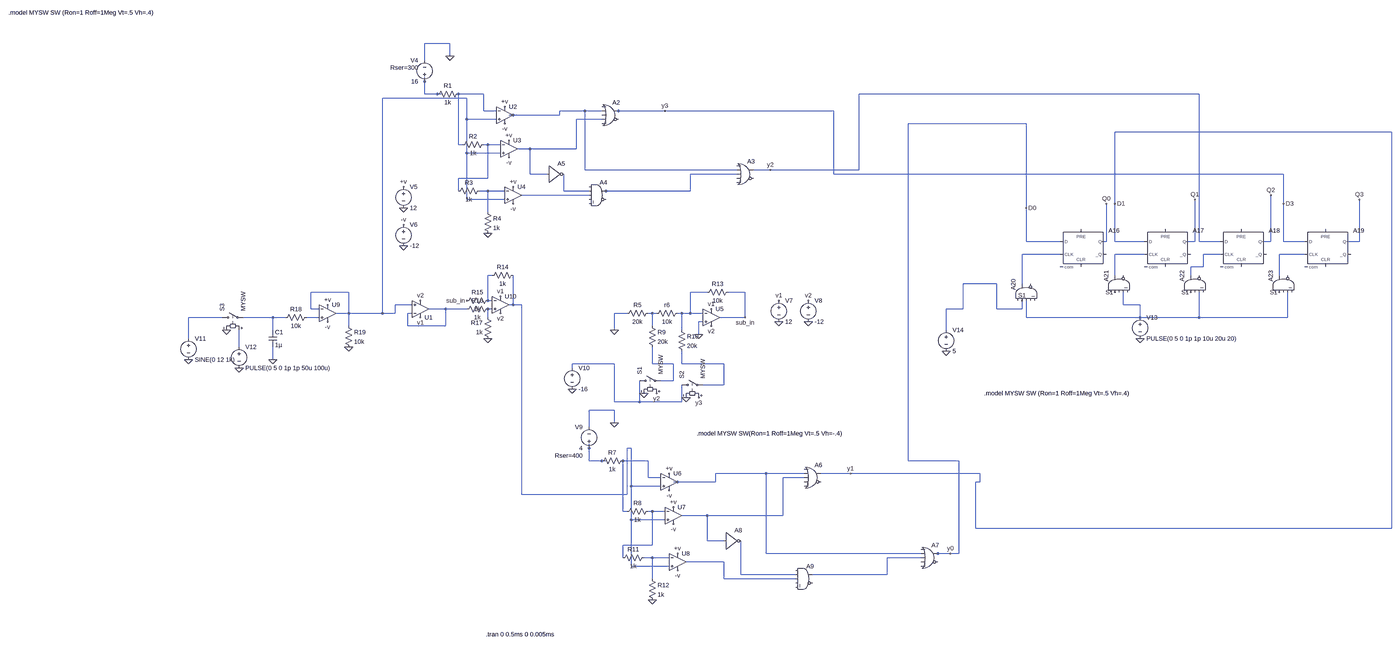
[diagram p0: schematic 4bit adc(half-flash).asc, whole sheet]
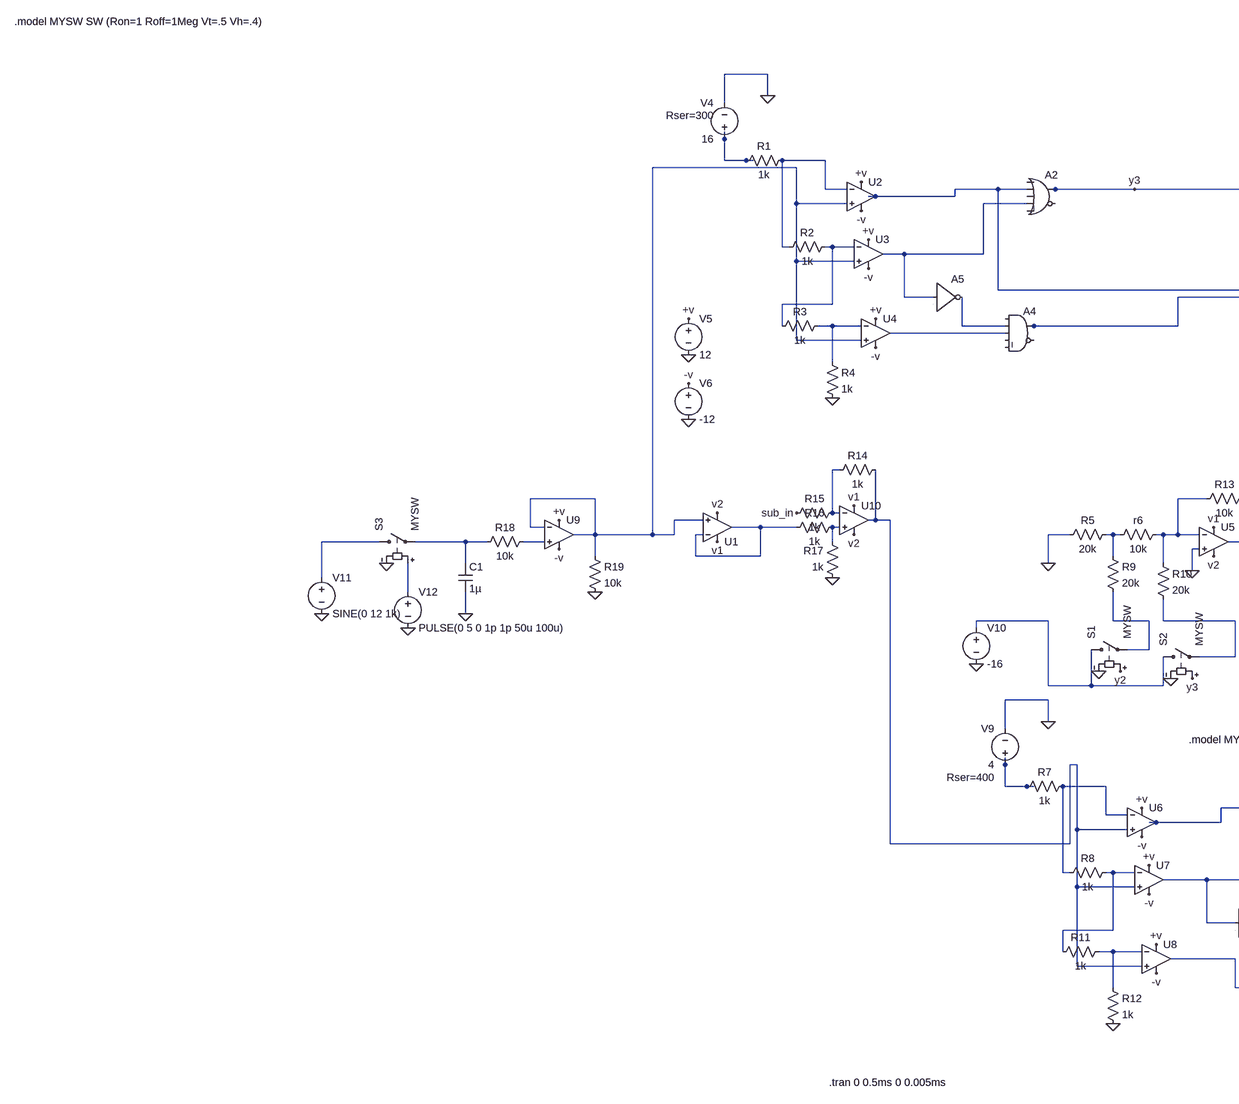
[diagram p1: schematic 4bit adc(half-flash).asc, part, row 1 of 1, column 1 of 2]
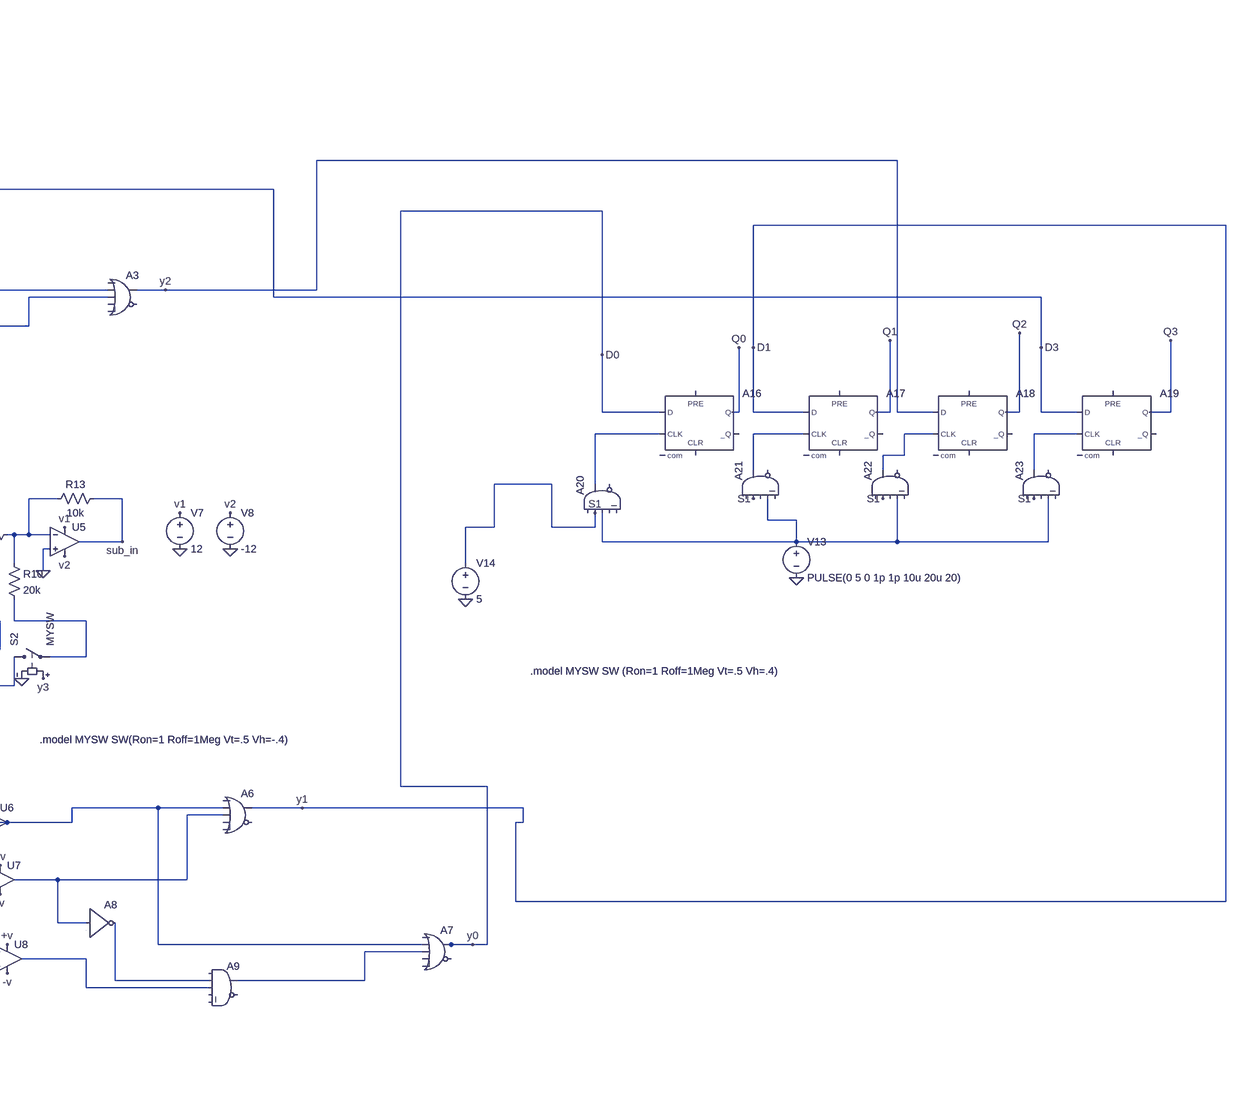
[diagram p2: schematic 4bit adc(half-flash).asc, part, row 1 of 1, column 2 of 2]
4bit adc(half-flash).asc, the LTspice schematic file:
Version 4
SHEET 1 3524 1444
WIRE -432 -832 -528 -832
WIRE -432 -784 -432 -832
WIRE -528 -768 -528 -832
WIRE -528 -688 -528 -704
WIRE -528 -640 -528 -688
WIRE -480 -640 -528 -640
WIRE -464 -640 -480 -640
WIRE -304 -640 -400 -640
WIRE 2416 -640 1120 -640
WIRE -368 -624 -688 -624
WIRE -304 -576 -304 -640
WIRE -256 -576 -304 -576
WIRE 80 -576 -16 -576
WIRE 144 -576 80 -576
WIRE 208 -576 192 -576
WIRE 384 -576 208 -576
WIRE 1024 -576 384 -576
WIRE -192 -560 -208 -560
WIRE -16 -560 -16 -576
WIRE -16 -560 -192 -560
WIRE -368 -544 -368 -624
WIRE -256 -544 -368 -544
WIRE 144 -544 48 -544
WIRE 1760 -528 1312 -528
WIRE 3520 -496 2096 -496
WIRE -400 -448 -400 -640
WIRE -384 -448 -400 -448
WIRE -288 -448 -304 -448
WIRE -240 -448 -288 -448
WIRE -128 -432 -176 -432
WIRE 48 -432 48 -544
WIRE 48 -432 -128 -432
WIRE -368 -416 -368 -544
WIRE -240 -416 -368 -416
WIRE 80 -352 80 -576
WIRE 656 -352 80 -352
WIRE 784 -352 720 -352
WIRE 1120 -352 1120 -640
WIRE 1120 -352 784 -352
WIRE -128 -336 -128 -432
WIRE -64 -336 -128 -336
WIRE 656 -336 480 -336
WIRE 1024 -336 1024 -576
WIRE 2736 -336 1024 -336
WIRE -288 -320 -288 -448
WIRE -288 -320 -400 -320
WIRE -400 -272 -400 -320
WIRE -288 -272 -320 -272
WIRE -224 -272 -288 -272
WIRE 0 -272 0 -336
WIRE 96 -272 0 -272
WIRE 160 -272 144 -272
WIRE 480 -272 480 -336
WIRE 480 -272 160 -272
WIRE 96 -256 -160 -256
WIRE -368 -240 -368 -416
WIRE -224 -240 -368 -240
WIRE 2096 -224 2096 -496
WIRE 2736 -224 2736 -336
WIRE 1760 -208 1760 -528
WIRE -288 -192 -288 -272
WIRE 1760 -80 1760 -208
WIRE 1888 -80 1760 -80
WIRE 2064 -80 2064 -224
WIRE 2064 -80 2048 -80
WIRE 2096 -80 2096 -224
WIRE 2208 -80 2096 -80
WIRE 2400 -80 2400 -240
WIRE 2400 -80 2368 -80
WIRE 2416 -80 2416 -640
WIRE 2496 -80 2416 -80
WIRE 2688 -80 2688 -256
WIRE 2688 -80 2656 -80
WIRE 2736 -80 2736 -224
WIRE 2816 -80 2736 -80
WIRE 3024 -80 3024 -240
WIRE 3024 -80 2976 -80
WIRE 1888 -32 1744 -32
WIRE 2208 -32 2096 -32
WIRE 2496 -32 2432 -32
WIRE 2816 -32 2720 -32
WIRE 2432 16 2432 -32
WIRE 2432 16 2384 16
WIRE -272 48 -288 48
WIRE 2096 48 2096 -32
WIRE 2384 48 2384 16
WIRE 2720 48 2720 -32
WIRE 1648 80 1520 80
WIRE 1744 80 1744 -32
WIRE -816 112 -960 112
WIRE 544 112 480 112
WIRE 688 112 624 112
WIRE -288 144 -288 48
WIRE -272 144 -288 144
WIRE -576 160 -640 160
WIRE -192 160 -192 48
WIRE -192 160 -208 160
WIRE -160 160 -192 160
WIRE 2128 160 2128 112
WIRE 2192 160 2128 160
WIRE -960 176 -960 112
WIRE -928 176 -960 176
WIRE -448 176 -512 176
WIRE -368 176 -448 176
WIRE -272 176 -288 176
WIRE 1520 176 1520 80
WIRE 1520 176 1456 176
WIRE 1648 176 1648 80
WIRE 1744 176 1744 144
WIRE 1744 176 1648 176
WIRE -816 192 -816 112
WIRE -816 192 -864 192
WIRE -688 192 -688 -624
WIRE -688 192 -816 192
WIRE -640 192 -640 160
WIRE -640 192 -688 192
WIRE -576 192 -592 192
WIRE 240 192 192 192
WIRE 336 192 320 192
WIRE 352 192 336 192
WIRE 448 192 432 192
WIRE 480 192 480 112
WIRE 480 192 448 192
WIRE 528 192 480 192
WIRE -1296 208 -1424 208
WIRE -1104 208 -1216 208
WIRE -1056 208 -1104 208
WIRE -928 208 -976 208
WIRE -288 208 -288 176
WIRE 688 208 688 112
WIRE 688 208 592 208
WIRE 1760 208 1760 144
WIRE 2192 208 2192 160
WIRE 2192 208 1760 208
WIRE 2416 208 2416 112
WIRE 2416 208 2192 208
WIRE 2752 208 2752 112
WIRE 2752 208 2416 208
WIRE 528 224 512 224
WIRE -816 240 -816 192
WIRE -592 240 -592 192
WIRE -448 240 -448 176
WIRE -448 240 -592 240
WIRE 336 240 336 192
WIRE -1104 256 -1104 208
WIRE 192 256 192 192
WIRE 448 256 448 192
WIRE 1456 256 1456 176
WIRE 512 272 512 224
WIRE -1424 288 -1424 208
WIRE -1232 320 -1232 256
WIRE -1104 368 -1104 320
WIRE 192 384 32 384
WIRE 336 384 336 320
WIRE 416 384 336 384
WIRE 448 384 448 336
WIRE 608 384 448 384
WIRE 32 400 32 384
WIRE 416 448 416 384
WIRE 416 448 368 448
WIRE 608 464 608 384
WIRE 608 464 528 464
WIRE 192 528 192 384
WIRE 288 528 288 448
WIRE 288 528 192 528
WIRE 448 528 448 464
WIRE 448 528 288 528
WIRE 192 560 96 560
WIRE 192 608 192 560
WIRE 96 624 96 560
WIRE 96 704 96 688
WIRE 256 704 240 704
WIRE 96 752 96 704
WIRE 144 752 96 752
WIRE 160 752 144 752
WIRE 320 752 224 752
WIRE 1312 752 1312 -528
WIRE 1504 752 1312 752
WIRE 768 800 576 800
WIRE 912 800 768 800
WIRE 1088 800 976 800
WIRE 1584 800 1088 800
WIRE 320 816 320 752
WIRE 368 816 320 816
WIRE 912 816 832 816
WIRE 432 832 416 832
WIRE 576 832 576 800
WIRE 576 832 432 832
WIRE 1584 832 1584 800
WIRE 1584 832 1568 832
WIRE 256 848 256 704
WIRE 368 848 256 848
WIRE -160 880 -160 160
WIRE 240 880 240 704
WIRE 240 880 -160 880
WIRE 224 944 224 752
WIRE 240 944 224 944
WIRE 336 944 320 944
WIRE 384 944 336 944
WIRE 544 960 448 960
WIRE 832 960 832 816
WIRE 832 960 544 960
WIRE 256 976 256 848
WIRE 384 976 256 976
WIRE 1568 1008 1568 832
WIRE 3520 1008 3520 -496
WIRE 3520 1008 1568 1008
WIRE 544 1056 544 960
WIRE 608 1056 544 1056
WIRE 336 1072 336 944
WIRE 336 1072 224 1072
WIRE 768 1104 768 800
WIRE 1360 1104 768 1104
WIRE 1424 1104 1408 1104
WIRE 1472 1104 1424 1104
WIRE 1504 1104 1504 752
WIRE 1504 1104 1472 1104
WIRE 224 1120 224 1072
WIRE 336 1120 304 1120
WIRE 400 1120 336 1120
WIRE 1360 1120 1232 1120
WIRE 608 1136 464 1136
WIRE 256 1152 256 976
WIRE 400 1152 256 1152
WIRE 672 1184 672 1056
WIRE 880 1184 672 1184
WIRE 1232 1184 1232 1120
WIRE 1232 1184 944 1184
WIRE 336 1200 336 1120
WIRE 608 1200 608 1136
WIRE 880 1200 608 1200
FLAG 512 272 0
FLAG 560 176 v1
FLAG 560 240 v2
FLAG 192 256 0
FLAG 688 208 sub_in
FLAG -368 144 sub_in
FLAG 2192 288 0
FLAG 1456 336 0
FLAG 2096 112 S1
FLAG 2384 112 S1
FLAG 2720 112 S1
FLAG 1744 144 S1
FLAG 2064 -224 Q0
FLAG 2400 -240 Q1
FLAG 2688 -256 Q2
FLAG 3024 -240 Q3
FLAG 1760 -208 D0
FLAG 2096 -224 D1
FLAG 2736 -224 D3
FLAG 816 224 0
FLAG 928 144 v2
FLAG 816 144 v1
FLAG 928 224 0
FLAG -240 128 v1
FLAG -240 192 v2
FLAG -288 288 0
FLAG -544 208 v1
FLAG -544 144 v2
FLAG -432 -784 0
FLAG -288 -112 0
FLAG -608 -64 0
FLAG -608 -208 0
FLAG -608 -288 +v
FLAG -224 -592 +v
FLAG -208 -464 +v
FLAG -192 -288 +v
FLAG -608 -144 -v
FLAG -224 -528 -v
FLAG -208 -400 -v
FLAG -192 -224 -v
FLAG 192 608 0
FLAG 336 1280 0
FLAG 400 800 +v
FLAG 416 928 +v
FLAG 432 1104 +v
FLAG 400 864 -v
FLAG 416 992 -v
FLAG 432 1168 -v
FLAG 384 -576 y3
FLAG 784 -352 y2
FLAG 1088 800 y1
FLAG 1472 1104 y0
FLAG 32 480 0
FLAG 304 496 0
FLAG 464 512 0
FLAG 352 496 y2
FLAG 512 512 y3
FLAG -1104 368 0
FLAG -1232 400 0
FLAG -1424 368 0
FLAG -896 160 +v
FLAG -896 224 -v
FLAG -816 320 0
FLAG -1280 256 0
SYMBOL res 336 176 R90
WINDOW 0 0 56 VBottom 2
WINDOW 3 32 56 VTop 2
SYMATTR InstName R5
SYMATTR Value 20k
SYMBOL res 448 176 R90
WINDOW 0 0 56 VBottom 2
WINDOW 3 32 56 VTop 2
SYMATTR InstName r6
SYMATTR Value 10k
SYMBOL res 320 224 R0
SYMATTR InstName R9
SYMATTR Value 20k
SYMBOL res 432 240 R0
SYMATTR InstName R10
SYMATTR Value 20k
SYMBOL OpAmps\\UniversalOpAmp 560 208 R0
SYMATTR InstName U5
SYMBOL res 640 96 R90
WINDOW 0 0 56 VBottom 2
WINDOW 3 32 56 VTop 2
SYMATTR InstName R13
SYMATTR Value 10k
SYMBOL voltage 816 128 R0
WINDOW 123 0 0 Left 0
WINDOW 39 0 0 Left 0
SYMATTR InstName V7
SYMATTR Value 12
SYMBOL voltage 928 128 R0
WINDOW 123 0 0 Left 0
WINDOW 39 0 0 Left 0
SYMATTR InstName V8
SYMATTR Value -12
SYMBOL Digital\\dflop 1968 -128 R0
SYMATTR InstName A16
SYMBOL Digital\\dflop 2288 -128 R0
SYMATTR InstName A17
SYMBOL Digital\\dflop 2576 -128 R0
SYMATTR InstName A18
SYMBOL Digital\\dflop 2896 -128 R0
SYMATTR InstName A19
SYMBOL voltage 2192 192 R0
WINDOW 123 0 0 Left 0
WINDOW 39 0 0 Left 0
SYMATTR InstName V13
SYMATTR Value PULSE(0 5 0 1p 1p 10u 20u 20)
SYMBOL voltage 1456 240 R0
WINDOW 123 0 0 Left 0
WINDOW 39 0 0 Left 0
SYMATTR InstName V14
SYMATTR Value 5
SYMBOL Digital\\and 1696 112 R270
SYMATTR InstName A20
SYMBOL Digital\\and 2048 80 R270
SYMATTR InstName A21
SYMBOL Digital\\and 2336 80 R270
SYMATTR InstName A22
SYMBOL Digital\\and 2672 80 R270
SYMATTR InstName A23
SYMBOL res -176 32 R90
WINDOW 0 0 56 VBottom 2
WINDOW 3 32 56 VTop 2
SYMATTR InstName R14
SYMATTR Value 1k
SYMBOL res -272 128 R90
WINDOW 0 0 56 VBottom 2
WINDOW 3 32 56 VTop 2
SYMATTR InstName R15
SYMATTR Value 1k
SYMBOL res -272 160 R90
WINDOW 0 0 56 VBottom 2
WINDOW 3 32 56 VTop 2
SYMATTR InstName R16
SYMATTR Value 1k
SYMBOL res -272 304 R180
WINDOW 0 36 76 Left 2
WINDOW 3 36 40 Left 2
SYMATTR InstName R17
SYMATTR Value 1k
SYMBOL OpAmps\\UniversalOpAmp2 -240 160 R0
SYMATTR InstName U10
SYMBOL OpAmps\\UniversalOpAmp2 -544 176 M180
SYMATTR InstName U1
SYMBOL OpAmps\\UniversalOpAmp2 -224 -560 R0
SYMATTR InstName U2
SYMBOL OpAmps\\UniversalOpAmp2 -208 -432 R0
SYMATTR InstName U3
SYMBOL OpAmps\\UniversalOpAmp2 -192 -256 R0
SYMATTR InstName U4
SYMBOL voltage -528 -672 R180
WINDOW 0 24 96 Left 2
WINDOW 3 24 16 Left 2
WINDOW 123 0 0 Left 0
WINDOW 39 24 68 Left 2
SYMATTR InstName V4
SYMATTR Value 16
SYMATTR SpiceLine Rser=300
SYMBOL res -384 -656 R90
WINDOW 0 0 56 VBottom 2
WINDOW 3 32 56 VTop 2
SYMATTR InstName R1
SYMATTR Value 1k
SYMBOL res -288 -464 R90
WINDOW 0 0 56 VBottom 2
WINDOW 3 32 56 VTop 2
SYMATTR InstName R2
SYMATTR Value 1k
SYMBOL res -304 -288 R90
WINDOW 0 0 56 VBottom 2
WINDOW 3 32 56 VTop 2
SYMATTR InstName R3
SYMATTR Value 1k
SYMBOL res -304 -208 R0
SYMATTR InstName R4
SYMATTR Value 1k
SYMBOL voltage -608 -304 R0
WINDOW 123 0 0 Left 0
WINDOW 39 0 0 Left 0
SYMATTR InstName V5
SYMATTR Value 12
SYMBOL voltage -608 -160 R0
WINDOW 123 0 0 Left 0
WINDOW 39 0 0 Left 0
SYMATTR InstName V6
SYMATTR Value -12
SYMBOL OpAmps\\UniversalOpAmp2 400 832 R0
SYMATTR InstName U6
SYMBOL OpAmps\\UniversalOpAmp2 416 960 R0
SYMATTR InstName U7
SYMBOL OpAmps\\UniversalOpAmp2 432 1136 R0
SYMATTR InstName U8
SYMBOL voltage 96 720 R180
WINDOW 0 24 96 Left 2
WINDOW 3 24 16 Left 2
WINDOW 123 0 0 Left 0
WINDOW 39 24 -12 Left 2
SYMATTR InstName V9
SYMATTR Value 4
SYMATTR SpiceLine Rser=400
SYMBOL res 240 736 R90
WINDOW 0 0 56 VBottom 2
WINDOW 3 32 56 VTop 2
SYMATTR InstName R7
SYMATTR Value 1k
SYMBOL res 336 928 R90
WINDOW 0 0 56 VBottom 2
WINDOW 3 32 56 VTop 2
SYMATTR InstName R8
SYMATTR Value 1k
SYMBOL res 320 1104 R90
WINDOW 0 0 56 VBottom 2
WINDOW 3 32 56 VTop 2
SYMATTR InstName R11
SYMATTR Value 1k
SYMBOL res 320 1184 R0
SYMATTR InstName R12
SYMATTR Value 1k
SYMBOL Digital\\or 176 -624 R0
SYMATTR InstName A2
SYMBOL Digital\\or 688 -400 R0
SYMATTR InstName A3
SYMBOL Digital\\and 128 -320 R0
SYMATTR InstName A4
SYMBOL Digital\\inv -64 -400 R0
SYMATTR InstName A5
SYMBOL Digital\\or 944 752 R0
SYMATTR InstName A6
SYMBOL Digital\\or 1392 1056 R0
SYMATTR InstName A7
SYMBOL Digital\\inv 608 992 R0
SYMATTR InstName A8
SYMBOL Digital\\and 912 1136 R0
SYMATTR InstName A9
SYMBOL voltage 32 384 R0
WINDOW 123 0 0 Left 0
WINDOW 39 0 0 Left 0
SYMATTR InstName V10
SYMATTR Value -16
SYMBOL sw 272 448 R270
SYMATTR InstName S1
SYMATTR Value MYSW
SYMBOL sw 432 464 R270
SYMATTR InstName S2
SYMATTR Value MYSW
SYMBOL voltage -1424 272 R0
WINDOW 123 0 0 Left 0
WINDOW 39 0 0 Left 0
SYMATTR InstName V11
SYMATTR Value SINE(0 12 1k)
SYMBOL voltage -1232 304 R0
WINDOW 123 0 0 Left 0
WINDOW 39 0 0 Left 0
SYMATTR InstName V12
SYMATTR Value PULSE(0 5 0 1p 1p 50u 100u)
SYMBOL cap -1120 256 R0
SYMATTR InstName C1
SYMATTR Value 1µ
SYMBOL res -960 192 R90
WINDOW 0 0 56 VBottom 2
WINDOW 3 32 56 VTop 2
SYMATTR InstName R18
SYMATTR Value 10k
SYMBOL OpAmps\\UniversalOpAmp2 -896 192 R0
SYMATTR InstName U9
SYMBOL res -832 224 R0
SYMATTR InstName R19
SYMATTR Value 10k
SYMBOL sw -1312 208 R270
SYMATTR InstName S3
SYMATTR Value MYSW
TEXT -296 1416 Left 2 !.tran 0 0.5ms 0 0.005ms
TEXT 1600 496 Left 2 !.model MYSW SW (Ron=1 Roff=1Meg Vt=.5 Vh=.4)
TEXT 504 648 Left 2 !.model MYSW SW(Ron=1 Roff=1Meg Vt=.5 Vh=-.4)
TEXT -2184 -1768 Left 2 !.model MYSW SW (Ron=1 Roff=1Meg Vt=.5 Vh=.4)

The netlist it stands for:
* 4bit adc(half-flash).asc
R5 N021 0 20k
r6 N016 N021 10k
R9 N021 N027 20k
R10 N016 N028 20k
XU5 0 N016 v1 v2 sub_in level1 Avol=1Meg GBW=10Meg Vos=0 En=0 Enk=0 In=0 Ink=0 Rin=500Meg  ; pins In+ In- V+ V- OUT
R13 sub_in N016 10k
V7 v1 0 12
V8 v2 0 -12
A16 y0 0 N011 0 0 0 Q0 0 DFLOP
A17 y1 0 N012 0 0 0 Q1 0 DFLOP
A18 y2 0 N013 0 0 0 Q2 0 DFLOP
A19 y3 0 N014 0 0 0 Q3 0 DFLOP
V13 N018 0 PULSE(0 5 0 1p 1p 10u 20u 20)
V14 S1 0 5
A20 0 S1 N018 0 0 0 N011 0 AND
A21 0 S1 0 N018 0 0 N012 0 AND
A22 0 S1 0 N018 0 0 N013 0 AND
A23 0 S1 0 N018 0 0 N014 0 AND
R14 N017 N015 1k
R15 N015 sub_in 1k
R16 N020 N019 1k
R17 0 N020 1k
XU10 N020 N015 v1 v2 N017 level2 Avol=1Meg GBW=10Meg Slew=10Meg Ilimit=25m Rail=0 Vos=0 En=0 Enk=0 In=0 Ink=0 Rin=500Meg  ; pins In+ In- V+ V- OUT
XU1 N003 N019 v1 v2 N019 level2 Avol=1Meg GBW=10Meg Slew=10Meg Ilimit=25m Rail=0 Vos=0 En=0 Enk=0 In=0 Ink=0 Rin=500Meg  ; pins In+ In- V+ V- OUT
XU2 N003 N002 +v -v N004 level2 Avol=1Meg GBW=10Meg Slew=10Meg Ilimit=25m Rail=0 Vos=0 En=0 Enk=0 In=0 Ink=0 Rin=500Meg  ; pins In+ In- V+ V- OUT
XU3 N003 N006 +v -v N005 level2 Avol=1Meg GBW=10Meg Slew=10Meg Ilimit=25m Rail=0 Vos=0 En=0 Enk=0 In=0 Ink=0 Rin=500Meg  ; pins In+ In- V+ V- OUT
XU4 N003 N008 +v -v N010 level2 Avol=1Meg GBW=10Meg Slew=10Meg Ilimit=25m Rail=0 Vos=0 En=0 Enk=0 In=0 Ink=0 Rin=500Meg  ; pins In+ In- V+ V- OUT
V4 N001 0 16 Rser=300
R1 N002 N001 1k
R2 N006 N002 1k
R3 N008 N006 1k
R4 N008 0 1k
V5 +v 0 12
V6 -v 0 -12
XU6 N017 N030 +v -v N031 level2 Avol=1Meg GBW=10Meg Slew=10Meg Ilimit=25m Rail=0 Vos=0 En=0 Enk=0 In=0 Ink=0 Rin=500Meg  ; pins In+ In- V+ V- OUT
XU7 N017 N033 +v -v N032 level2 Avol=1Meg GBW=10Meg Slew=10Meg Ilimit=25m Rail=0 Vos=0 En=0 Enk=0 In=0 Ink=0 Rin=500Meg  ; pins In+ In- V+ V- OUT
XU8 N017 N034 +v -v N036 level2 Avol=1Meg GBW=10Meg Slew=10Meg Ilimit=25m Rail=0 Vos=0 En=0 Enk=0 In=0 Ink=0 Rin=500Meg  ; pins In+ In- V+ V- OUT
V9 N029 0 4 Rser=400
R7 N030 N029 1k
R8 N033 N030 1k
R11 N034 N033 1k
R12 N034 0 1k
A2 0 N004 0 N005 0 0 y3 0 OR
A3 0 N004 N007 0 0 0 y2 0 OR
A4 0 N009 N010 0 0 0 N007 0 AND
A5 N005 0 0 0 0 N009 0 0 BUF
A6 0 N031 N032 0 0 0 y1 0 OR
A7 0 N031 N035 0 0 0 y0 0 OR
A8 N032 0 0 0 0 N037 0 0 BUF
A9 0 N037 N036 0 0 0 N035 0 AND
V10 N026 0 -16
S1 N026 N027 y2 0 MYSW
S2 N026 N028 y3 0 MYSW
V11 N022 0 SINE(0 12 1k)
V12 N025 0 PULSE(0 5 0 1p 1p 50u 100u)
C1 N023 0 1µ
R18 N024 N023 10k
XU9 N024 N003 +v -v N003 level2 Avol=1Meg GBW=10Meg Slew=10Meg Ilimit=25m Rail=0 Vos=0 En=0 Enk=0 In=0 Ink=0 Rin=500Meg  ; pins In+ In- V+ V- OUT
R19 N003 0 10k
S3 N022 N023 N025 0 MYSW
.tran 0 0.5ms 0 0.005ms
.model MYSW SW (Ron=1 Roff=1Meg Vt=.5 Vh=.4)
.model MYSW SW(Ron=1 Roff=1Meg Vt=.5 Vh=-.4)
.model MYSW SW (Ron=1 Roff=1Meg Vt=.5 Vh=.4)
.lib UniversalOpAmp1.lib
.lib UniversalOpAmp2.lib
.backanno
.end